# EAGLE design modem2_double (EAGLE 7.5.0)
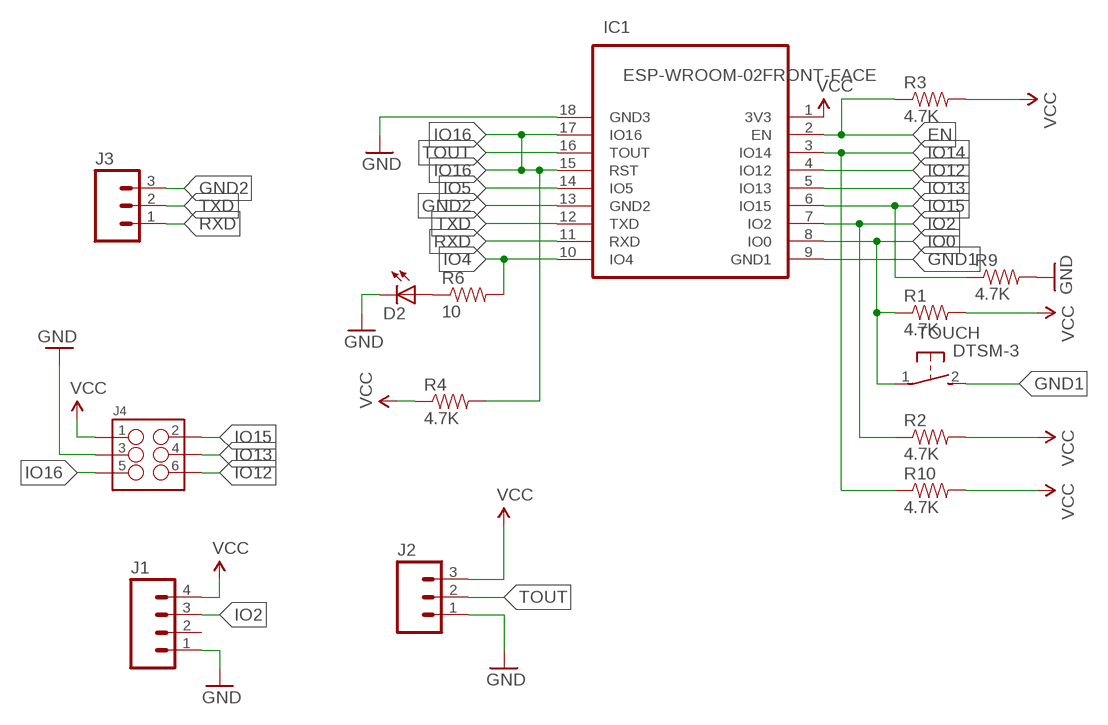
[diagram p0: schematic, sheet 1]

## Parts
D2  LEDCHIPLED_0805  [CHIPLED_0805]
IC1  ESP-WROOM-02FRONT-FACE  [FRONT-FACE]
J1  M04NO_SILK_ALL_ROUND  [1X04_NO_SILK_ALL_ROUND]
J2  M03PTH  [1X03]
J3  M031X03_NO_SILK  [1X03_NO_SILK]
J4  M03X2SHROUD  [2X3-SHROUDED]
R1  4.7K  RESISTOR0805-RES  [0805]
R2  4.7K  RESISTOR0805-RES  [0805]
R3  4.7K  RESISTOR0805-RES  [0805]
R4  4.7K  RESISTOR0805-RES  [0805]
R6  10  RESISTOR0805-RES  [0805]
R9  4.7K  RESISTOR0805-RES  [0805]
R10  4.7K  RESISTOR0805-RES  [0805]
TOUCH  DTSM-3  [DTSM-3]

## Nets
EN: IC1.2(EN) R3.1
GND: D2.C IC1.18(GND3) J1.1 J2.1 J4.3 R9.2
GND1: IC1.9(GND1) TOUCH.2
GND2: IC1.13(GND2) J3.3
IO0: IC1.8(IO0) R1.1 TOUCH.1
IO2: IC1.7(IO2) J1.3 R2.1
IO4: IC1.10(IO4) R6.2
IO5: IC1.14(IO5)
IO12: IC1.4(IO12) J4.6
IO13: IC1.5(IO13) J4.4
IO14: IC1.3(IO14) R10.1
IO15: IC1.6(IO15) J4.2 R9.1
IO16: IC1.15(RST) IC1.17(IO16) J4.5 R4.2
N$2: D2.A R6.1
RXD: IC1.11(RXD) J3.1
TOUT: IC1.16(TOUT) J2.2
TXD: IC1.12(TXD) J3.2
VCC: IC1.1(3V3) J1.4 J2.3 J4.1 R1.2 R2.2 R3.2 R4.1 R10.2
Unconnected: J1.2

## Library data of the parts
D2 = adafruit:LED: LED OSRAM: - CHIPLED LG R971, LG N971, LY N971, LG Q971, LY Q971, LO R971, LY R971 LH N974, LH R974 LS Q976, LO Q976, LY Q976 LO Q996 - Hyper CHIPLED LW Q18S LB Q993, LB Q99A, LB R99A - SideLED LS A670, LO A670, LY A670, LG A670, LP A670 LB A673, LV A673, LT A673, LW A673 LH A674 LY A675 LS A676, LA A676, LO A676, LY A676, LW A676 LS A679, LY A679, LG A679 - Hyper Micro SIDELED® LS Y876, LA Y876, LO Y876, LY Y876 LT Y87S - SmartLED LW L88C, LW L88S LB L89C, LB L89S, LG L890 LS L89K, LO L89K, LY L89K LS L896, LA L896, LO L896, LY L896 - TOPLED LS T670, LO T670, LY T670, LG T670, LP T670 LSG T670, LSP T670, LSY T670, LOP T670, LYG T670 LG T671, LOG T671, LSG T671 LB T673, LV T673, LT T673, LW T673 LH T674 LS T676, LA T676, LO T676, LY T676, LB T676, LH T676, LSB T676, LW T676 LB T67C, LV T67C, LT T67C, LS T67K, LO T67K, LY T67K, LW E67C LS E67B, LA E67B, LO E67B, LY E67B, LB E67C, LV E67C, LT E67C LW T67C LS T679, LY T679, LG T679 LS T770, LO T770, LY T770, LG T770, LP T770 LB T773, LV T773, LT T773, LW T773 LH T774 LS E675, LA E675, LY E675, LS T675 LS T776, LA T776, LO T776, LY T776, LB T776 LHGB T686 LT T68C, LB T68C - Hyper Mini TOPLED® LB M676 - Mini TOPLED Santana® LG M470 LS M47K, LO M47K, LY M47K Source: http://www.osram.convergy.de/
IC1 = esp-wroom-02:ESP-WROOM-02: WiFi module - ESP-WROOM-02
J1 = SparkFun-Connectors:M04: Header 4 Standard 4-pin 0.1" header. Use with straight break away headers (SKU : PRT-00116), right angle break away headers (PRT-00553), swiss pins (PRT-00743), machine pins (PRT-00117), and female headers (PRT-00115). Molex polarized connector foot print use with SKU : PRT-08231 with associated crimp pins and housings. 1MM SMD Version SKU: PRT-10208; PROD_ID: CONN-09696
J2 J3 = SparkFun-Connectors:M03: Header 3 Standard 3-pin 0.1" header. Use with straight break away headers (SKU : PRT-00116), right angle break away headers (PRT-00553), swiss pins (PRT-00743), machine pins (PRT-00117), and female headers (PRT-00115). Molex polarized connector foot print use with SKU : PRT-08232 with associated crimp pins and housings.
J4 = SparkFun-Connectors:M03X2: 2x3 .1" header. Shrouded, with keying- CONN-10681 SMT- CONN-11415 Pogo pins- HW-11044; PROD_ID: CONN-10681
R1-R4 R6 R9 R10 = SparkFun-Passives:RESISTOR: Resistor Basic schematic elements and footprints for 0603, 1206, and PTH resistors.
TOUCH = switch-tact:DTSM-3

## Board
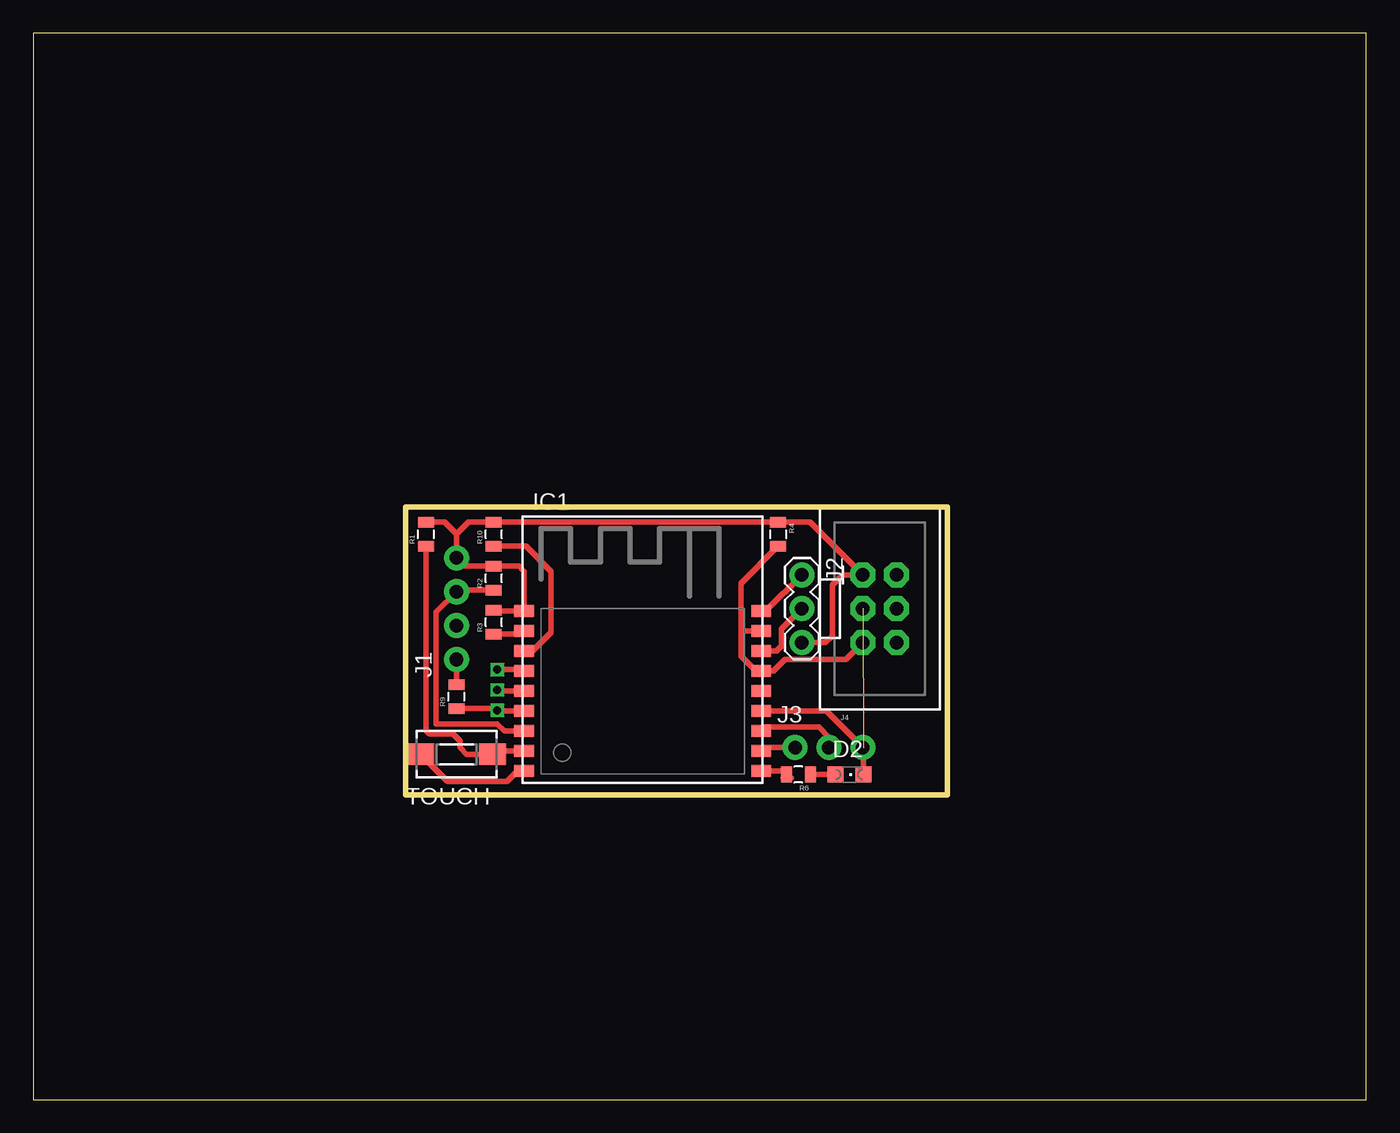
[diagram p1: board, top side]
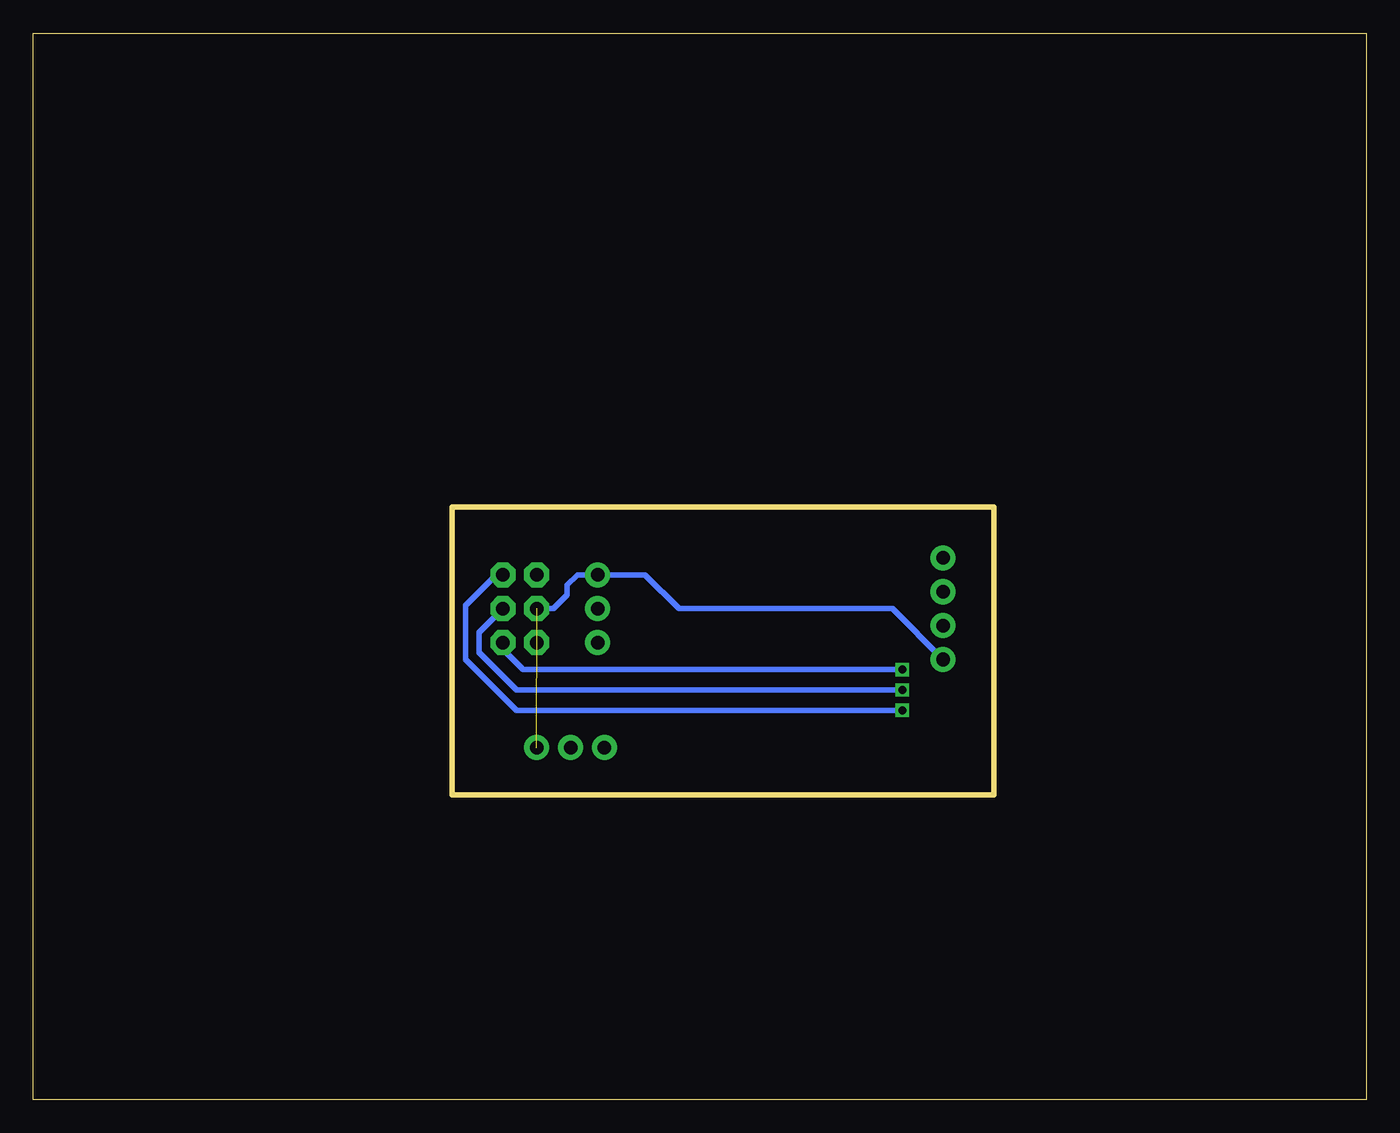
[diagram p2: board, bottom side, seen from below]

Size 100 x 80 mm. Coordinates in mm from the lower left corner, seen from the top.
Outline: 0,0 100,0 100,80 0,80 0,0
Outline: 68.58,44.45 68.58,22.86 27.94,22.86 27.94,44.45 68.58,44.45
Copper layers (1*16): Top 0.035mm / dielectric 1.5mm / Bottom 0.035mm
Design rules "default": minimum track width 10mil, minimum drill 24mil, track to track 8mil, track to pad 8mil, pad to pad 8mil, via to via 8mil, smd to smd 8mil, copper to edge 40mil, drill to drill 8mil, minimum pad ring 10mil, minimum via ring 8mil, stop-mask expansion 4mil, vias tented up to drill 0mil, thermal gap 10mil

### Footprints (pad centres in the part's own frame; a part is rotated, then mirrored left to right if it is on the bottom)
CHIPLED_0805 = smd 1.2 x 1.2: A 0,-1.05; C 0,1.05
FRONT-FACE = smd 1.485 x 0.9: 1 -8.893,4.9; 2 -8.893,3.4; 3 -8.893,1.9; 4 -8.893,0.4; 5 -8.893,-1.1; 6 -8.893,-2.6; 7 -8.893,-4.1; 8 -8.893,-5.6; 9 -8.893,-7.1; 10 8.893,-7.1; 11 8.893,-5.6; 12 8.893,-4.1; 13 8.893,-2.6; 14 8.893,-1.1; 15 8.893,0.4; 16 8.893,1.9; 17 8.893,3.4; 18 8.893,4.9
1X04_NO_SILK_ALL_ROUND = drill 1.016 pad 1.88: 1 0,0; 2 2.54,0; 3 5.08,0; 4 7.62,0
1X03 = drill 1.016 pad 1.88: 1 0,0; 2 2.54,0; 3 5.08,0
1X03_NO_SILK = drill 1.016 pad 1.88: 1 0,0; 2 2.54,0; 3 5.08,0
2X3-SHROUDED = drill 1.016 pad 1.88 octagon: 1 -1.27,2.54; 2 1.27,2.54; 3 -1.27,0; 4 1.27,0; 5 -1.27,-2.54; 6 1.27,-2.54
0805 = smd 0.8 x 1.2: 1 -0.9,0; 2 0.9,0
DTSM-3 = smd 2 x 1.6: 1 -2.7,0; 2 2.7,0

### Placement (x,y rotation side)
D2  61.21,24.38 270 top
IC1  45.72,31.75 0 top
J1  31.75,33.02 90 top
J2  57.66,39.37 270 top
J3  57.15,26.42 0 top
J4  63.5,36.83 0 top
R1  29.46,42.42 90 top
R2  34.54,39.12 90 top
R3  34.54,35.81 90 top
R4  55.88,42.42 270 top
R6  57.4,24.38 180 top
R9  31.75,30.23 90 top
R10  34.54,42.42 90 top
TOUCH  31.75,25.91 180 top

### Tracks (layer width: path | path; a pad name or v marks a point on that pad's centre or on a via)
EN
  Top 0.406: R3.1 36.59,34.91 IC1.2
GND  (1 unrouted)
  Top 0.406: R9.2 J1.1 | D2.C 62.26,26.38 | IC1.18 54.94,36.65 J2.1
  Bottom 0.406: J1.1 35.56,36.83 51.56,36.83 54.1,39.37 J2.1 59.18,39.37 59.94,38.61 59.94,37.85 60.96,36.83 J4.3
GND1
  Top 0.254: IC1.9 36.8,24.69 36.35,24.69 36.33,24.65
  Top 0.406: 36.33,24.65 35.56,23.88 31.08,23.88 TOUCH.2
GND2
  Top 0.406: IC1.13 59.5,29.15 J3.3
IO0
  Top 0.406: IC1.8 34.69,26.15 TOUCH.1 32.51,25.91 32,26.42 32,26.92 31.5,27.43 29.72,27.43 29.46,27.69 R1.1
IO2
  Top 0.406: R2.1 31.87,38.22 J1.3 30.23,36.58 30.23,28.19 34.8,28.19 35.34,27.65 IC1.7
IO4
  Top 0.406: IC1.10 56.38,24.65 56.9,24.13 56.25,24.13 R6.2
IO12  (via drill 0.6)
  Top 0.406: v34.8,32.26 36.72,32.26 IC1.4
  Bottom 0.406: J4.6 64.77,33.78 63.25,32.26 v34.8,32.26
IO13  (via drill 0.6)
  Top 0.406: IC1.5 34.88,30.65 v34.8,30.73
  Bottom 0.406: v34.8,30.73 63.75,30.73 66.55,33.53 66.55,35.05 J4.4
IO14
  Top 0.406: R10.1 36.97,41.52 38.86,39.62 38.86,35.05 37.34,33.53 36.95,33.53 IC1.3
IO15  (via drill 0.6)
  Top 0.406: 31.75,29.15 R9.1 34.68,29.33 v34.8,29.21 34.86,29.15 IC1.6
  Bottom 0.406: J4.2 65.28,39.37 67.56,37.08 67.56,33.02 63.75,29.21 v34.8,29.21
IO16
  Top 0.406: 54.93,35.24 IC1.17 53.09,35.15 | 53.09,35.15 53.09,33.27 54.21,32.15 IC1.15 55.52,32.15 56.39,33.02 60.96,33.02 J4.5 | 53.09,35.15 53.09,38.72 R4.2
N$2
  Top 0.406: R6.1 D2.A
N$3  (via drill 0.6)
  other vias: 34.8,32.26
RXD
  Top 0.406: J3.1 54.88,26.42 IC1.11
TOUT
  Top 0.406: IC1.16 54.93,33.66 55.75,33.66 56.13,34.04 56.13,35.31 J2.2
TXD
  Top 0.406: J3.2 59.69,27.18 58.93,27.94 54.9,27.94 IC1.12
VCC
  Top 0.406: 31.75,42.42 32.65,43.32 R10.2 R4.1 58.28,43.32 J4.1 60.71,39.37 59.94,38.61 59.94,34.8 59.44,34.29 J2.3 | 31.75,42.42 J1.4 32.37,40.02 R2.2 36.44,40.02 36.83,39.62 IC1.1 34.61,36.65 R3.2 | R1.2 30.85,43.32 31.75,42.42